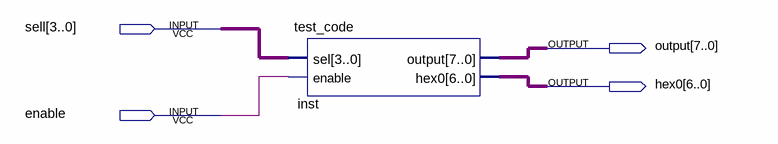
[diagram p0: schematic sheet]
// Quartus schematic InClass4.bdf as structural Verilog: 1 symbols, 4 pins
module InClass4 (
  input  [3:0] sell,
  input  enable,
  output [7:0] \output ,
  output [6:0] hex0
);

  test_code inst (.sel(sell), .enable(enable), .\output (\output ), .hex0(hex0));
endmodule
